# Altium schematic sheet DAC.SchDoc: =DocumentName
size A4; CompanyName: "AS Manufacturing" LLC; Organization: "AS Manufacturing" LLC; Address1: 5 Sklyarenka St.; Address2: Kyiv 04073; Address3: Ukraine; Address4: https://ajax.systems/en/; DocumentNumber: 4; SheetNumber: 4; SheetTotal: 7; Template_version: 1.0.1
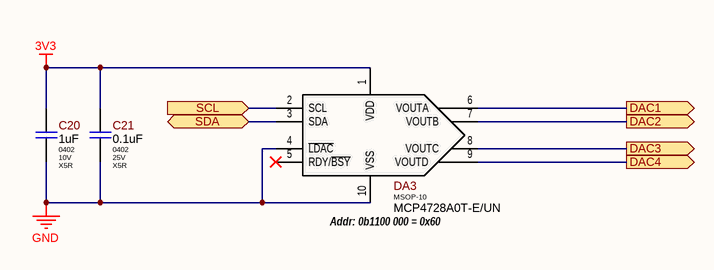
[diagram p0: DAC.SchDoc]

## Parts
C20  Package: 0402  Voltage: 10V  Dielectric Type: X5R  [C_CERAMIC_0402_MED]  (hidden comment: 1uF)
C21  Package: 0402  Voltage: 25V  Dielectric Type: X5R  [C_CERAMIC_0402_MED]  (hidden comment: 0.1uF)
DA3  MCP4728A0T-E/UN  [MSOP-10]

## Ports
DAC1 (out), DAC2 (out), DAC3 (out), DAC4 (out), SCL (in), SDA (bidir)

## Nets
3V3: C20.1 C21.1 DA3.1(VDD)
GND: C20.2 C21.2 DA3.4(~{LDAC}) DA3.10(VSS)
DAC1: DA3.6(VOUTA) ; port DAC1
DAC2: DA3.7(VOUTB) ; port DAC2
DAC3: DA3.8(VOUTC) ; port DAC3
DAC4: DA3.9(VOUTD) ; port DAC4
SCL: DA3.2(SCL) ; port SCL
SDA: DA3.3(SDA) ; port SDA

Not connected (* = marked no-connect by the designer): DA3 5(RDY/~{BSY})*

## Notes on the sheet
- (near DA3) Addr: 0b1100 000 = 0x60
- Title
- Product:
- Project:
- Size:
- Date:
- Variant:
- A4
- Authors:
- Time:
- Sheet
- of
- Rev:
- Commit:

## Library data of the parts
C20 = CL05A105KP5NNNC: 1uF 10V Х5R ±10% 0402 Ceramic Capacitor RoHS; Manufacturer: Samsung Electro-Mechanics; Ajax_1C_ID: 23659; Ajax_1C_PN: 1uF 10V Х5R 10% 0402 Samsung CL05A105KP5NNNC Ceramic Capacitor SMD RoHS; Standard Lead Time: 18 Weeks; Replacement: NONE; Ajax_1С_Status: Mass Production; Component Status: Released; GUID_1C: 556ec478-1f42-11eb-ab6d-0050569f2651; Value: 1uF; Part Number: CL05A105KP5NNNC; Part Type: Ceramic / X5R / 0402; Component Type: SMD; Temperature Range: -55°C ~ 85°C; Tolerance: ±10%; ComponentLink1URL: https://media.digikey.com/pdf/Data%20Sheets/Samsung%20PDFs/CL_Series_MLCC_ds.pdf; Supplier 1: Digi-Key; Supplier Part Number 1: 1276-1076-2-ND; ComponentLink1Description: Datasheet; Price: 0.00141
C21 = CL05A104KA5NNNC: 100nF 25V X5R ±10% 0402 Ceramic Capacitor RoHS; Manufacturer: Samsung Electro-Mechanics; Ajax_1C_ID: 27170; Ajax_1C_PN: 100nF 25V X5R 10% 0402 CL05A104KA5NNNC Ceramic Capacitor SMD RoHS; Standard Lead Time: 38 Weeks; Component Status: Released; Replacement: NONE; GUID_1C: 6c9121f0-7733-11eb-ab70-0050569f2651; Ajax_1С_Status: Mass Production; Value: 0.1uF; Part Number: CL05A104KA5NNNC; Part Type: Ceramic / X5R / 0402; Component Type: SMD; Temperature Range: -55°C ~ 85°C; Tolerance: ±10%; ComponentLink1URL: https://eu.mouser.com/datasheet/2/585/MLCC-1837944.pdf; ComponentLink1Description: Datasheet; Price: 0.0013; Supplier 1: Mouser; Supplier Part Number 1: 187-CL05A104KA5NNNC
DA3 = MCP4728A0T-E/UN: 12-Bit, Quad Digital-to-Analog Converter with EEPROM Memory, MSOP-10; Manufacturer: Microchip Technology; Ajax_1C_ID: 39734; Ajax_1C_PN: MCP4728A0T-E/UN MSOP-10 мікросхема; Ajax_1С_Status: Mass Production; Standard Lead Time: 52 Weeks; Component Status: Released; Replacement: NONE; GUID_1C: ce0ad344-8e40-11ec-a90d-00505699469b; Package: MSOP-10; Part Number: MCP4728A0T-E/UN; Part Type: DAC; Component Type: SMD; Temperature Range: -40°C ~ 125°C; ComponentLink1URL: https://ww1.microchip.com/downloads/en/DeviceDoc/22187E.pdf; Supplier 1: Digi-Key; Supplier Part Number 1: MCP4728A0T-E/UNTR-ND; Price: 2.09; ComponentLink1Description: Datasheet